# Altium schematic sheet llrf_afe_pwr_input.SchDoc: =GlobalProjectName
size 209 x 297 mm; SheetNumber: 17; SheetTotal: 17; PageSetup: Record=PageOptions|CenterHorizontal=True|CenterVertical=True|PrintScale=1.00|XCorrection=1.00|YCorrection=1.00|PrintKind=1|BorderSize=5000000|LeftOffset=0|BottomOffset=0|Orientation=2|PaperLength=1000|PaperWidth=1000|Scale=100|PaperSource=15|PrintQuality=1200|MediaType=1|DitherType=10|PaperKind=A3|PrintScaleMode=1; Weight: -; ScaleFactor: -
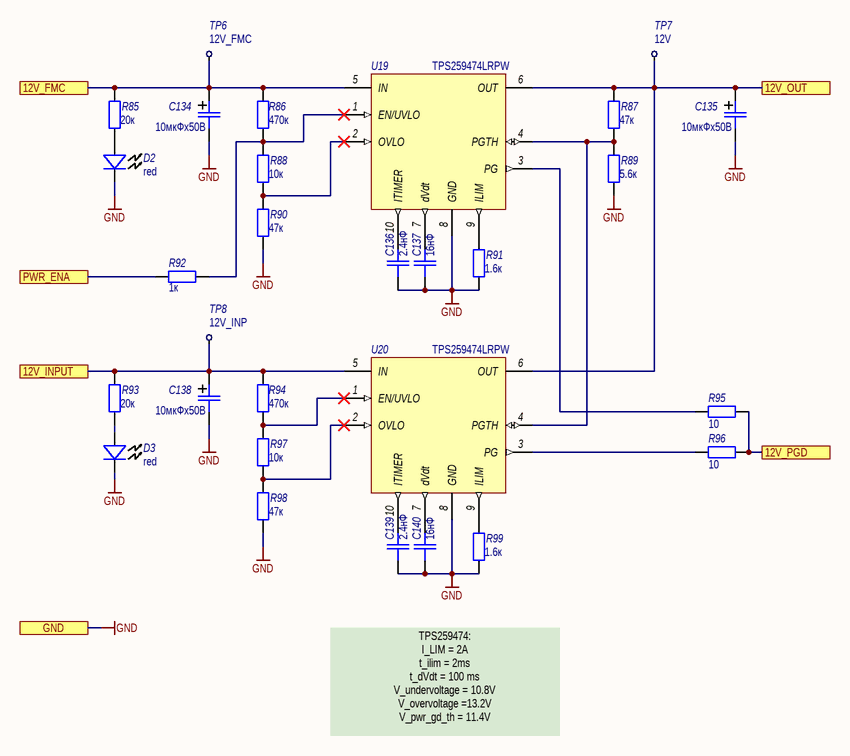
[diagram p0: llrf_afe_pwr_input.SchDoc]

## Parts
C134  10мкФх50В  [SMD_size_B]
C135  10мкФх50В  [SMD_size_B]
C136  2.4нФ  [SMD_C0603]
C137  16нФ  [SMD_C0603]
C138  10мкФх50В  [SMD_size_B]
C139  2.4нФ  [SMD_C0603]
C140  16нФ  [SMD_C0603]
D2  value red  [LED-0805]  (hidden comment: LED)
D3  value red  [LED-0805]  (hidden comment: LED)
R85  20к  [SMD_0603]
R86  470к  [SMD_0603]
R87  47к  [SMD_0603]
R88  10к  [SMD_0603]
R89  5.6к  [SMD_0603]
R90  47к  [SMD_0603]
R91  1.6к  [SMD_0603]
R92  1к  [SMD_0603]
R93  20к  [SMD_0603]
R94  470к  [SMD_0603]
R95  10  [SMD_0603]
R96  10  [SMD_0603]
R97  10к  [SMD_0603]
R98  47к  [SMD_0603]
R99  1.6к  [SMD_0603]
TP6  12V_FMC  [TestPoint]
TP7  12V  [TestPoint]
TP8  12V_INP  [TestPoint]
U19  Наименование: TPS259474LRPW  [VQFN-HR-10]  (hidden comment: TPS25947x)
U20  Наименование: TPS259474LRPW  [VQFN-HR-10]  (hidden comment: TPS25947x)

## Ports
12V_FMC, 12V_INPUT, 12V_OUT, 12V_PGD, GND, PWR_ENA

## Nets
GND: C134.2 C135.2 C136.1 C137.1 C138.2 C139.1 C140.1 D2.2(K) D3.2(K) R89.1 R90.1 R91.1 R98.1 R99.1 U19.8(GND) U20.8(GND) ; port GND
12V_FMC: C134.1 R85.2 R86.2 TP6.0(TP) U19.5(IN) ; port 12V_FMC
12V_INPUT: C138.1 R93.2 R94.2 TP8.0(TP) U20.5(IN) ; port 12V_INPUT
12V_OUT: C135.1 R87.2 TP7.0(TP) U19.6(OUT) U20.6(OUT) ; port 12V_OUT
12V_PGD: R95.1 R96.1 ; port 12V_PGD
PWR_ENA: R92.2 ; port PWR_ENA
NetC136_2: C136.2 U19.10(ITIMER)
NetC137_2: C137.2 U19.7(dVdt)
NetC139_2: C139.2 U20.10(ITIMER)
NetC140_2: C140.2 U20.7(dVdt)
NetD2_1: D2.1(A) R85.1
NetD3_1: D3.1(A) R93.1
NetR86_1: R86.1 R88.2 R92.1 U19.1(EN/UVLO)
NetR87_1: R87.1 R89.2 U19.4(PGTH) U20.4(PGTH)
NetR88_1: R88.1 R90.2 U19.2(OVLO)
NetR91_2: R91.2 U19.9(ILIM)
NetR94_1: R94.1 R97.2 U20.1(EN/UVLO)
NetR95_2: R95.2 U19.3(PG)
NetR96_2: R96.2 U20.3(PG)
NetR97_1: R97.1 R98.2 U20.2(OVLO)
NetR99_2: R99.2 U20.9(ILIM)

## Notes on the sheet
- TPS259474:
  I_LIM = 2A
  t_ilim = 2ms
  t_dVdt = 100 ms
  V_undervoltage = 10.8V
  V_overvoltage =13.2V
  V_pwr_gd_th = 11.4V
- Подп. и дата
- Инв. № дубл.
- Взам. инв. №
- Инв. № подл.
- Изм.
- Лист
- № докум.
- Подп.
- Дата
- Форма 2а ГОСТ 2.104-2006
- Копировал
- Формат А4

## Library data of the parts
C134 C135 C138 = Capacitor_pol: Polarized capacitor; Назначение: Поляризованный SMD-конденсатор; Наименование: Поляризованный конденсатор; Потребление, Вт: 0; Value: 10мкФх50В
C136 C137 C139 C140 = Capacitor: Назначение: SMD-конденсатор; Наименование: Конденсатор; Потребление, Вт: 0; Точность: %; Напряжение: В; Диэлектрик: *
  C136 C139: Value: 2.4нФ
  C137 C140: Value: 16нФ
D2 D3 = LED: Назначение: Светодиод; Наименование: SMD-LED; Потребление, Вт: 0,01
R85-R99 = Resistor: Наименование: Резистор; Назначение: SMD-резистор; Потребление, Вт: 0,001
  R85 R93: Value: 20к
  R86 R94: Value: 470к
  R87 R90 R98: Value: 47к
  R88 R97: Value: 10к
  R89: Value: 5.6к
  R91 R99: Value: 1.6к
  R92: Value: 1к
  R95 R96: Value: 10
TP6-TP8 = TP: Наименование: Точка проверки; Назначение: Контроль параметров платы
  TP6: TP_Name: 12V_FMC
  TP7: TP_Name: 12V
  TP8: TP_Name: 12V_INP
U19 U20 = TPS25947x: TPS25947xx, 2.7 - 23 V, 5.5 A, 28-mΩ True Reverse Current Blocking eFuse with Input / Reverse Polarity Protection /; Потребление, Вт: 0,05; Назначение: 2.7 - 23 V, 5.5 A, 28-mΩ True Reverse Current Blocking eFuse with Input; ComponentLink1Description: DataSheet; ComponentLink1URL: https://www.ti.com/lit/ds/symlink/tps25947.pdf?ts=1621925066842&ref_url=https%253A%252F%252Fwww.ti.com%252Fproduct%252FTPS25947%253FkeyMatch%253DTPS25947%2526tisearch%253Dsearch-everything%2526usecase%253DGPN